# EAGLE design maple-base (EAGLE 7.3.0)
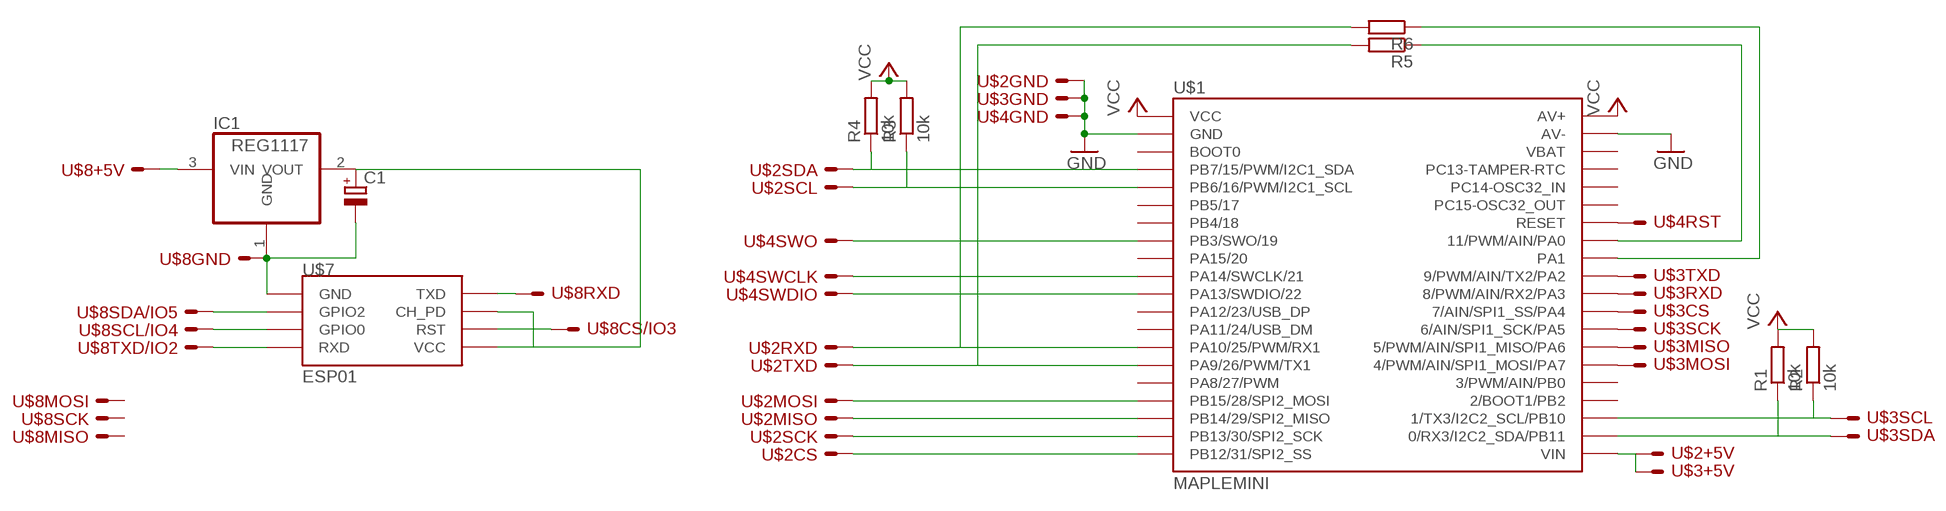
[diagram p0: schematic, sheet 1]

## Parts
C1  CPOL-EUB45181A  [B45181A]
IC1  REG1117  [SOT223]
R1  10k  R-EU_0207/7  [0207/7]
R2  10k  R-EU_0207/7  [0207/7]
R3  10k  R-EU_0207/7  [0207/7]
R4  10k  R-EU_0207/7  [0207/7]
R5  R-EU_0207/7  [0207/7]
R6  R-EU_0207/7  [0207/7]
U$1  MAPLEMINI  [20-DIP]
U$2  SPI_BUS  [SPI_BUS]
U$3  SPI_BUS  [SPI_BUS]
U$4  SWD  [SWD]
U$7  ESP01  [ESP01]
U$8  LIMERO_BUS  [SPI_BUS]

## Nets
GND: U$1.2(GND) U$1.39(AV-) U$2.GND U$3.GND U$4.GND
N$1: U$1.11(PA13/SWDIO/22) U$4.SWDIO
N$2: U$1.10(PA14/SWCLK/21) U$4.SWCLK
N$3: U$1.34(RESET) U$4.RST
N$4: R5.1 U$1.33(11/PWM/AIN/PA0)
N$5: R6.2 U$1.14(PA10/25/PWM/RX1) U$2.RXD
N$6: R5.2 U$1.15(PA9/26/PWM/TX1) U$2.TXD
N$7: U$1.18(PB14/29/SPI2_MISO) U$2.MISO
N$8: U$1.17(PB15/28/SPI2_MOSI) U$2.MOSI
N$9: U$1.19(PB13/30/SPI2_SCK) U$2.SCK
N$10: U$1.20(PB12/31/SPI2_SS) U$2.CS
N$11: R4.1 U$1.4(PB7/15/PWM/I2C1_SDA) U$2.SDA
N$12: R3.1 U$1.5(PB6/16/PWM/I2C1_SCL) U$2.SCL
N$13: U$1.30(8/PWM/AIN/RX2/PA3) U$3.RXD
N$14: U$1.31(9/PWM/AIN/TX2/PA2) U$3.TXD
N$15: U$1.29(7/AIN/SPI1_SS/PA4) U$3.CS
N$16: U$1.28(6/AIN/SPI1_SCK/PA5) U$3.SCK
N$17: U$1.27(5/PWM/AIN/SPI1_MISO/PA6) U$3.MISO
N$18: U$1.26(4/PWM/AIN/SPI1_MOSI/PA7) U$3.MOSI
N$19: R2.1 U$1.23(1/TX3/I2C2_SCL/PB10) U$3.SCL
N$20: R1.1 U$1.22(0/RX3/I2C2_SDA/PB11) U$3.SDA
N$21: U$1.21(VIN) U$2.+5V U$3.+5V
N$22: U$1.8(PB3/SWO/19) U$4.SWO
N$23: R6.1 U$1.32(PA1)
N$27: C1.- IC1.1(GND) U$7.GND U$8.GND
N$28: U$7.RX(RXD) U$8.TXD
N$29: U$7.TX(TXD) U$8.RXD
N$30: U$7.RST U$8.CS
N$31: IC1.3(VIN) U$8.+5V
N$32: C1.+ IC1.2(VOUT) U$7.CH_PD U$7.VCC
N$33: U$7.GPIO0 U$8.SCL
N$34: U$7.GPIO2 U$8.SDA
VCC: R1.2 R2.2 R3.2 R4.2 U$1.1(VCC) U$1.40(AV+)
Unconnected: U$1.3(BOOT0) U$1.6(PB5/17) U$1.7(PB4/18) U$1.9(PA15/20) U$1.12(PA12/23/USB_DP) U$1.13(PA11/24/USB_DM) U$1.16(PA8/27/PWM) U$1.24(2/BOOT1/PB2) U$1.25(3/PWM/AIN/PB0) U$1.35(PC15-OSC32_OUT) U$1.36(PC14-OSC32_IN) U$1.37(PC13-TAMPER-RTC) U$1.38(VBAT) U$8.MISO U$8.MOSI U$8.SCK

## Library data of the parts
C1 = resistor:CPOL-EU: POLARIZED CAPACITOR, European symbol
IC1 = burr-brown:REG1117: 800mA and 1A Low Dropout (LDO) Positive Regulator 1.8V, 2.5V, 2.85V, 3.3V, 5V, and Adj; MPN: REG1117; OC_FARNELL: 1097566; OC_NEWARK: 14P6981
R1-R6 = rcl:R-EU_: RESISTOR, European symbol
U$1 = maplemini:MAPLEMINI
U$2 U$3 = lieven:SPI_BUS
U$4 = lieven:SWD
U$7 = esp8266modules:ESP01: ESP8266 Wifi module 01
U$8 = lieven:LIMERO_BUS

## Board
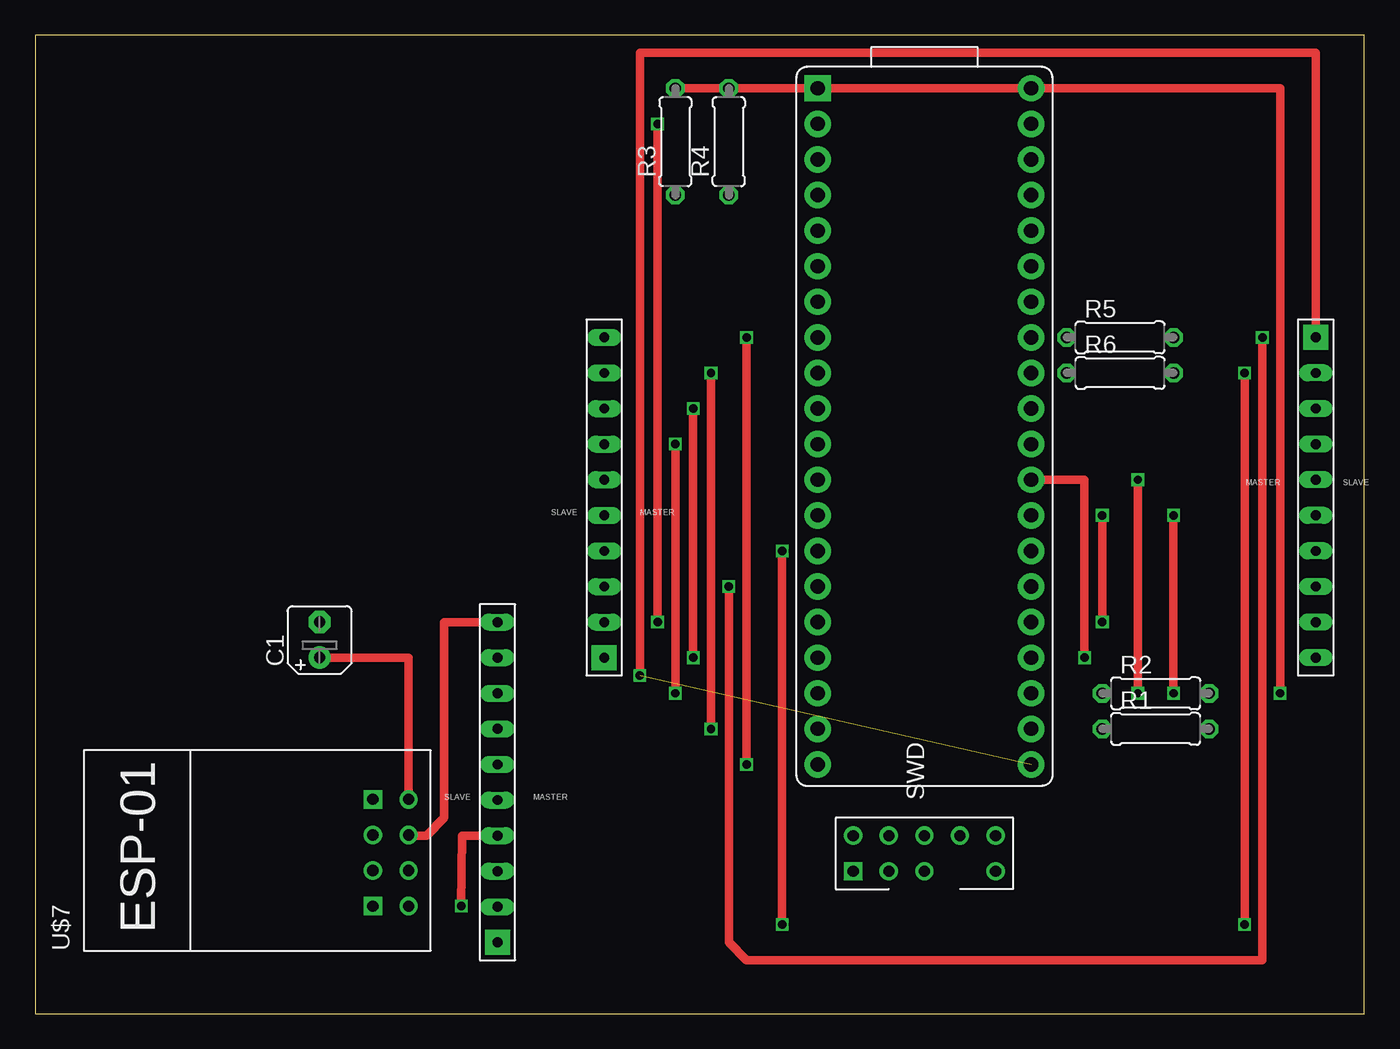
[diagram p1: board, top side]
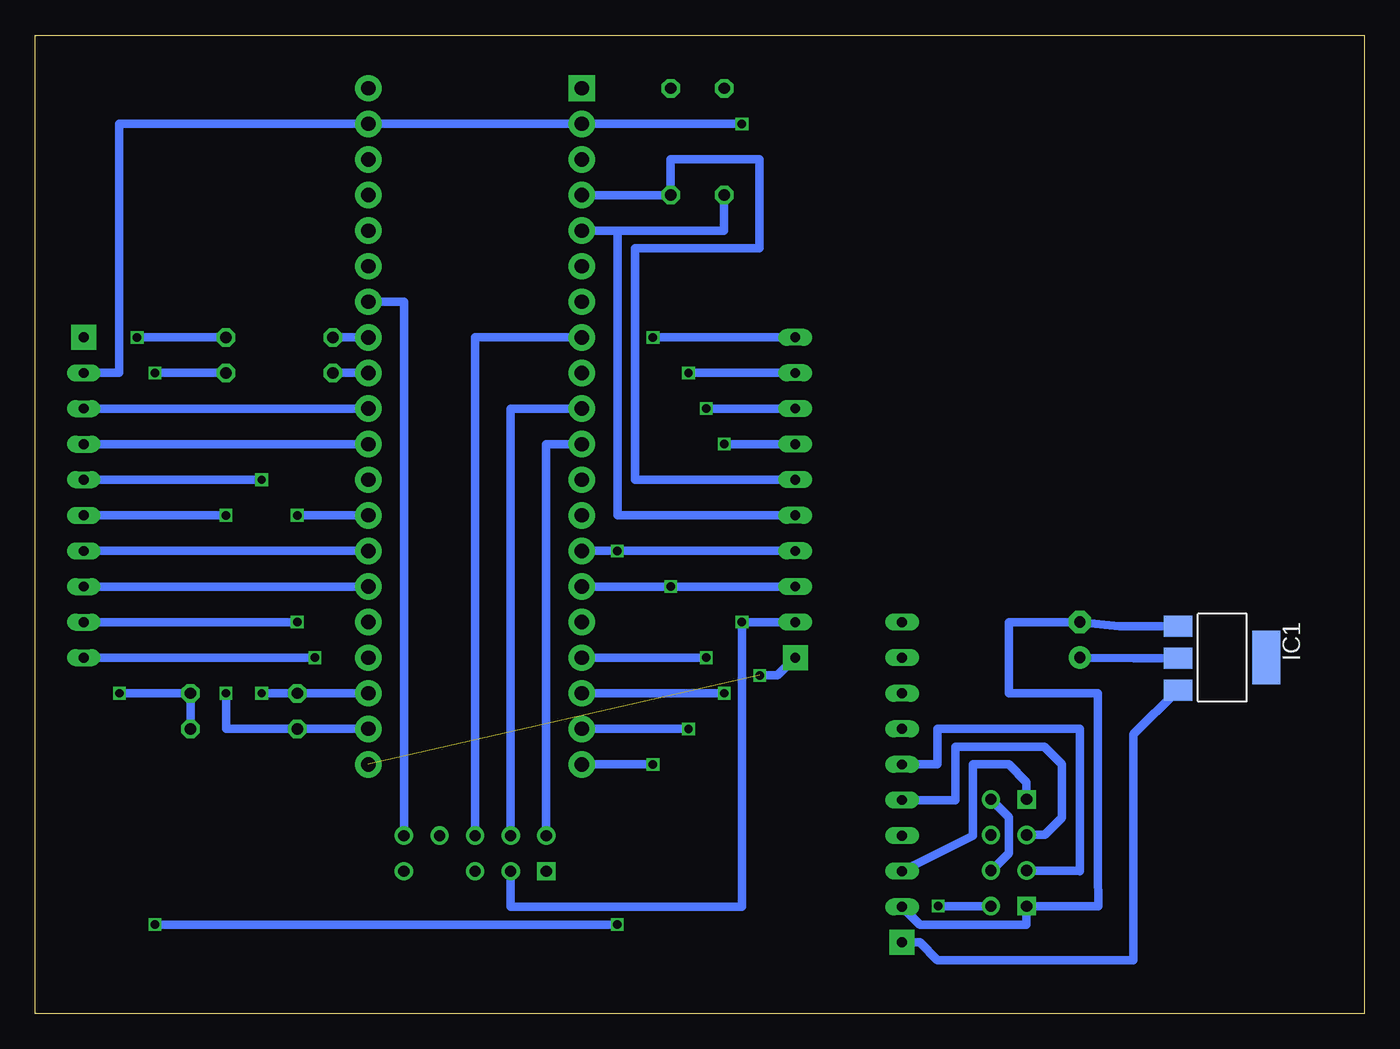
[diagram p2: board, bottom side, seen from below]

Size 94.92 x 69.84 mm. Coordinates in mm from the lower left corner, seen from the top.
Outline: 0,0 94.92,0 94.92,69.84 0,69.84 0,0
Copper layers (1*16): Top 0.035mm / dielectric 1.5mm / Bottom 0.035mm
Design rules "dirt_cheap_dirty_boards.v1 *": minimum track width 5mil, minimum drill 12mil, track to track 5mil, track to pad 5mil, pad to pad 5mil, via to via 5mil, smd to smd 0mil, copper to edge 10mil, drill to drill 10mil, minimum pad ring 10mil, minimum via ring 6mil, stop-mask expansion 2mil, vias tented up to drill 25mil, thermal gap 10mil

### Footprints (pad centres in the part's own frame; a part is rotated, then mirrored left to right if it is on the bottom)
B45181A = drill 0.813 pad 1.6: + -1.27,0 | drill 0.813 pad 1.6 octagon: - 1.27,0
SOT223 = smd 1.499 x 2.007: 1 -2.261,-3.15; 2 0.025,-3.15; 3 2.311,-3.15 | smd 3.81 x 2.007: 4 0,3.15
0207/7 = drill 0.813 octagon: 1 -3.81,0; 2 3.81,0
20-DIP = drill 1.016 pad 1.88 square: 1 -24.13,-7.62 | drill 1.016 pad 1.88: 2 -21.59,-7.62; 3 -19.05,-7.62; 4 -16.51,-7.62; 5 -13.97,-7.62; 6 -11.43,-7.62; 7 -8.89,-7.62; 8 -6.35,-7.62; 9 -3.81,-7.62; 10 -1.27,-7.62; 11 1.27,-7.62; 12 3.81,-7.62; 13 6.35,-7.62; 14 8.89,-7.62; 15 11.43,-7.62; 16 13.97,-7.62; 17 16.51,-7.62; 18 19.05,-7.62; 19 21.59,-7.62; 20 24.13,-7.62; 21 24.13,7.62; 22 21.59,7.62; 23 19.05,7.62; 24 16.51,7.62; 25 13.97,7.62; 26 11.43,7.62; 27 8.89,7.62; 28 6.35,7.62; 29 3.81,7.62; 30 1.27,7.62; 31 -1.27,7.62; 32 -3.81,7.62; 33 -6.35,7.62; 34 -8.89,7.62; 35 -11.43,7.62; 36 -13.97,7.62; 37 -16.51,7.62; 38 -19.05,7.62; 39 -21.59,7.62; 40 -24.13,7.62
SPI_BUS = drill 0.7 pad 1.778 square: +5V 0,0 | drill 0.7 long: CS 0,22.86; GND 0,2.54; MISO 0,15.24; MOSI 0,17.78; RXD 0,7.62; SCK 0,20.32; SCL 0,10.16; SDA 0,12.7; TXD 0,5.08
SWD = drill 0.8 square: +VCC 0,10.16 | drill 0.8: GND 0,7.62; GND1 0,5.08; GND2 0,0; N/U 2.54,2.54; RST 2.54,0; SWCLK 2.54,7.62; SWDIO 2.54,10.16; SWO 2.54,5.08
ESP01 = drill 0.8: CH_PD 2.59,0.001; GPIO0 5.13,2.541; GPIO2 2.59,2.541; RST 5.13,0.001; TX 0.05,0.001; VCC 7.67,0.001 | drill 0.8 square: GND 0.05,2.541; RX 7.67,2.541

### Placement (x,y rotation side)
C1  20.32,26.67 90 top
IC1  10.16,25.4 270 bottom
R1  80.01,20.32 0 top
R2  80.01,22.86 0 top
R3  45.72,62.23 90 top
R4  49.53,62.23 90 top
R5  77.47,48.26 0 top
R6  77.47,45.72 0 top
U$1  63.5,41.91 270 top
U$2  40.64,25.4 0 top
U$3  91.44,48.26 180 top
U$4  68.58,10.16 90 top
U$7  26.67,7.62 90 top
U$8  33.02,5.08 0 top

### Tracks (layer width: path | path; a pad name or v marks a point on that pad's centre or on a via)
GND  (via drill 0.6)
  Top 0.61: v44.45,63.5 v44.45,27.94
  Bottom 0.61: U$4.GND 60.96,7.62 44.45,7.62 v44.45,27.94 U$2.GND | v44.45,63.5 U$1.2 U$1.39 88.9,63.5 88.9,45.72 U$3.GND
N$1
  Bottom 0.61: U$1.11 58.42,40.64 U$4.SWDIO
N$2
  Bottom 0.61: U$1.10 60.96,43.18 U$4.SWCLK
N$3
  Bottom 0.61: U$4.RST 68.58,50.8 U$1.34
N$4
  Bottom 0.61: U$1.33 R5.1
N$5  (via drill 0.6)
  Top 0.61: v86.36,45.72 v86.36,6.35 | v53.34,33.02 v53.34,6.35
  Bottom 0.61: U$2.RXD v53.34,33.02 U$1.14 | R6.2 v86.36,45.72 | v86.36,6.35 v53.34,6.35
N$6  (via drill 0.6)
  Top 0.61: v87.63,48.26 87.63,3.81 50.8,3.81 49.53,5.08 v49.53,30.48
  Bottom 0.61: U$2.TXD v49.53,30.48 U$1.15 | R5.2 v87.63,48.26
N$7  (via drill 0.6)
  Top 0.61: v45.72,22.86 v45.72,40.64
  Bottom 0.61: U$1.18 v45.72,22.86 | v45.72,40.64 U$2.MISO
N$8  (via drill 0.6)
  Top 0.61: v46.99,25.4 v46.99,43.18
  Bottom 0.61: U$1.17 v46.99,25.4 | v46.99,43.18 U$2.MOSI
N$9  (via drill 0.6)
  Top 0.61: v48.26,45.72 v48.26,20.32
  Bottom 0.61: U$2.SCK v48.26,45.72 | v48.26,20.32 U$1.19
N$10  (via drill 0.6)
  Top 0.61: v50.8,48.26 v50.8,17.78
  Bottom 0.61: U$2.CS v50.8,48.26 | v50.8,17.78 U$1.20
N$11
  Bottom 0.61: U$1.4 R4.1 49.53,60.96 43.18,60.96 43.18,54.61 52.07,54.61 52.07,38.1 U$2.SDA
N$12
  Bottom 0.61: U$1.5 53.34,55.88 | 53.34,55.88 45.72,55.88 R3.1 | U$2.SCL 53.34,35.56 53.34,55.88
N$13
  Bottom 0.61: U$1.30 U$3.RXD
N$14
  Bottom 0.61: U$1.31 U$3.TXD
N$15  (via drill 0.6)
  Top 0.61: U$1.29 74.93,38.1 v74.93,25.4
  Bottom 0.61: v74.93,25.4 U$3.CS
N$16  (via drill 0.6)
  Top 0.61: v76.2,35.56 v76.2,27.94
  Bottom 0.61: U$1.28 v76.2,35.56 | v76.2,27.94 U$3.SCK
N$17
  Bottom 0.61: U$1.27 U$3.MISO
N$18
  Bottom 0.61: U$3.MOSI U$1.26
N$19  (via drill 0.6)
  Top 0.61: v78.74,38.1 v78.74,22.86
  Bottom 0.61: U$1.23 R2.1 v78.74,22.86 | U$3.SCL v78.74,38.1
N$20  (via drill 0.6)
  Top 0.61: v81.28,22.86 v81.28,35.56
  Bottom 0.61: U$1.22 R1.1 81.28,20.32 v81.28,22.86 | v81.28,35.56 U$3.SDA
N$21  (via drill 0.6)  (1 unrouted)
  Top 0.61: U$3.+5V 91.44,68.58 43.18,68.58 v43.18,24.13
  Bottom 0.61: v43.18,24.13 41.91,24.13 U$2.+5V
N$22
  Bottom 0.61: U$4.SWO 63.5,48.26 U$1.8
N$23
  Bottom 0.61: U$1.32 R6.1
N$27
  Bottom 0.61: IC1.1 17.5,27.66 C1.- 25.4,27.94 25.4,22.86 19.05,22.86 19.05,10.16 19,7.67 U$7.GND 24.13,6.35 31.75,6.35 U$8.GND
N$28
  Bottom 0.61: U$7.RX 24.13,16.51 25.4,17.78 27.94,17.78 27.94,12.7 U$8.TXD
N$29  (via drill 0.6)
  Top 0.61: v30.43,7.67 30.48,12.7 U$8.RXD
  Bottom 0.61: U$7.TX v30.43,7.67
N$30
  Top 0.61: U$8.CS 29.21,27.94 29.21,13.97 27.94,12.7 26.72,12.7 U$7.RST
N$31
  Bottom 0.61: U$8.+5V 31.75,5.08 30.48,3.81 16.51,3.81 16.51,19.94 IC1.3
N$32
  Top 0.61: U$7.VCC 26.67,25.4 C1.+
  Bottom 0.61: IC1.2 16.48,25.38 C1.+ | U$7.CH_PD 26.62,10.21 25.4,11.43 25.4,14.02 U$7.VCC
N$33
  Bottom 0.61: U$7.GPIO0 22.81,12.75 21.59,13.97 21.59,17.78 22.86,19.05 29.21,19.05 29.21,15.24 U$8.SCL
N$34
  Bottom 0.61: U$7.GPIO2 20.37,10.21 20.32,10.16 20.32,20.32 30.48,20.32 30.48,17.78 U$8.SDA
VCC  (via drill 0.6)
  Top 0.61: R3.2 R4.2 U$1.1 U$1.40 88.9,66.04 v88.9,22.86
  Bottom 0.61: v88.9,22.86 R2.2 R1.2

### Text on the board
tDocu: Limero-1